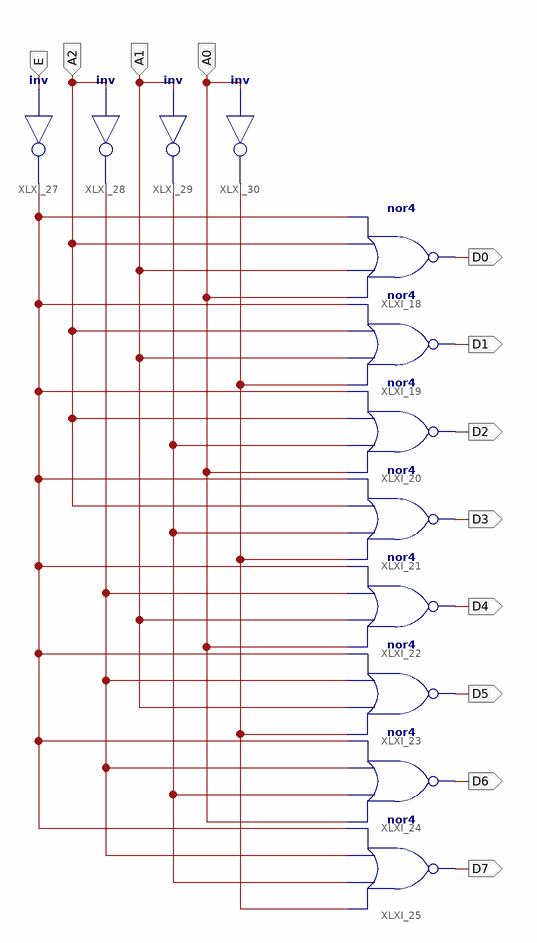
[diagram p0: schematic sheet 1]
// Xilinx ISE schematic decoder_3to8.sch (virtex6) as structural Verilog: 12 symbols, 12 ports
module decoder_3to8 (
  input  E,
  input  A2,
  input  A1,
  input  A0,
  output D0,
  output D1,
  output D2,
  output D3,
  output D4,
  output D5,
  output D6,
  output D7
);

  wire XLXN_23, XLXN_27, XLXN_34, XLXN_40;

  nor XLXI_18 (D0, A0, A1, A2, XLXN_23);
  nor XLXI_19 (D1, XLXN_27, A1, A2, XLXN_23);
  nor XLXI_20 (D2, A0, XLXN_34, A2, XLXN_23);
  nor XLXI_21 (D3, XLXN_27, XLXN_34, A2, XLXN_23);
  nor XLXI_22 (D4, A0, A1, XLXN_40, XLXN_23);
  nor XLXI_23 (D5, XLXN_27, A1, XLXN_40, XLXN_23);
  nor XLXI_24 (D6, A0, XLXN_34, XLXN_40, XLXN_23);
  nor XLXI_25 (D7, XLXN_27, XLXN_34, XLXN_40, XLXN_23);
  not XLXI_27 (XLXN_23, E);
  not XLXI_28 (XLXN_40, A2);
  not XLXI_29 (XLXN_34, A1);
  not XLXI_30 (XLXN_27, A0);
endmodule
